# EAGLE design LB_BIT_i23-threshold-v03(1_1) (EAGLE 6.6.0)
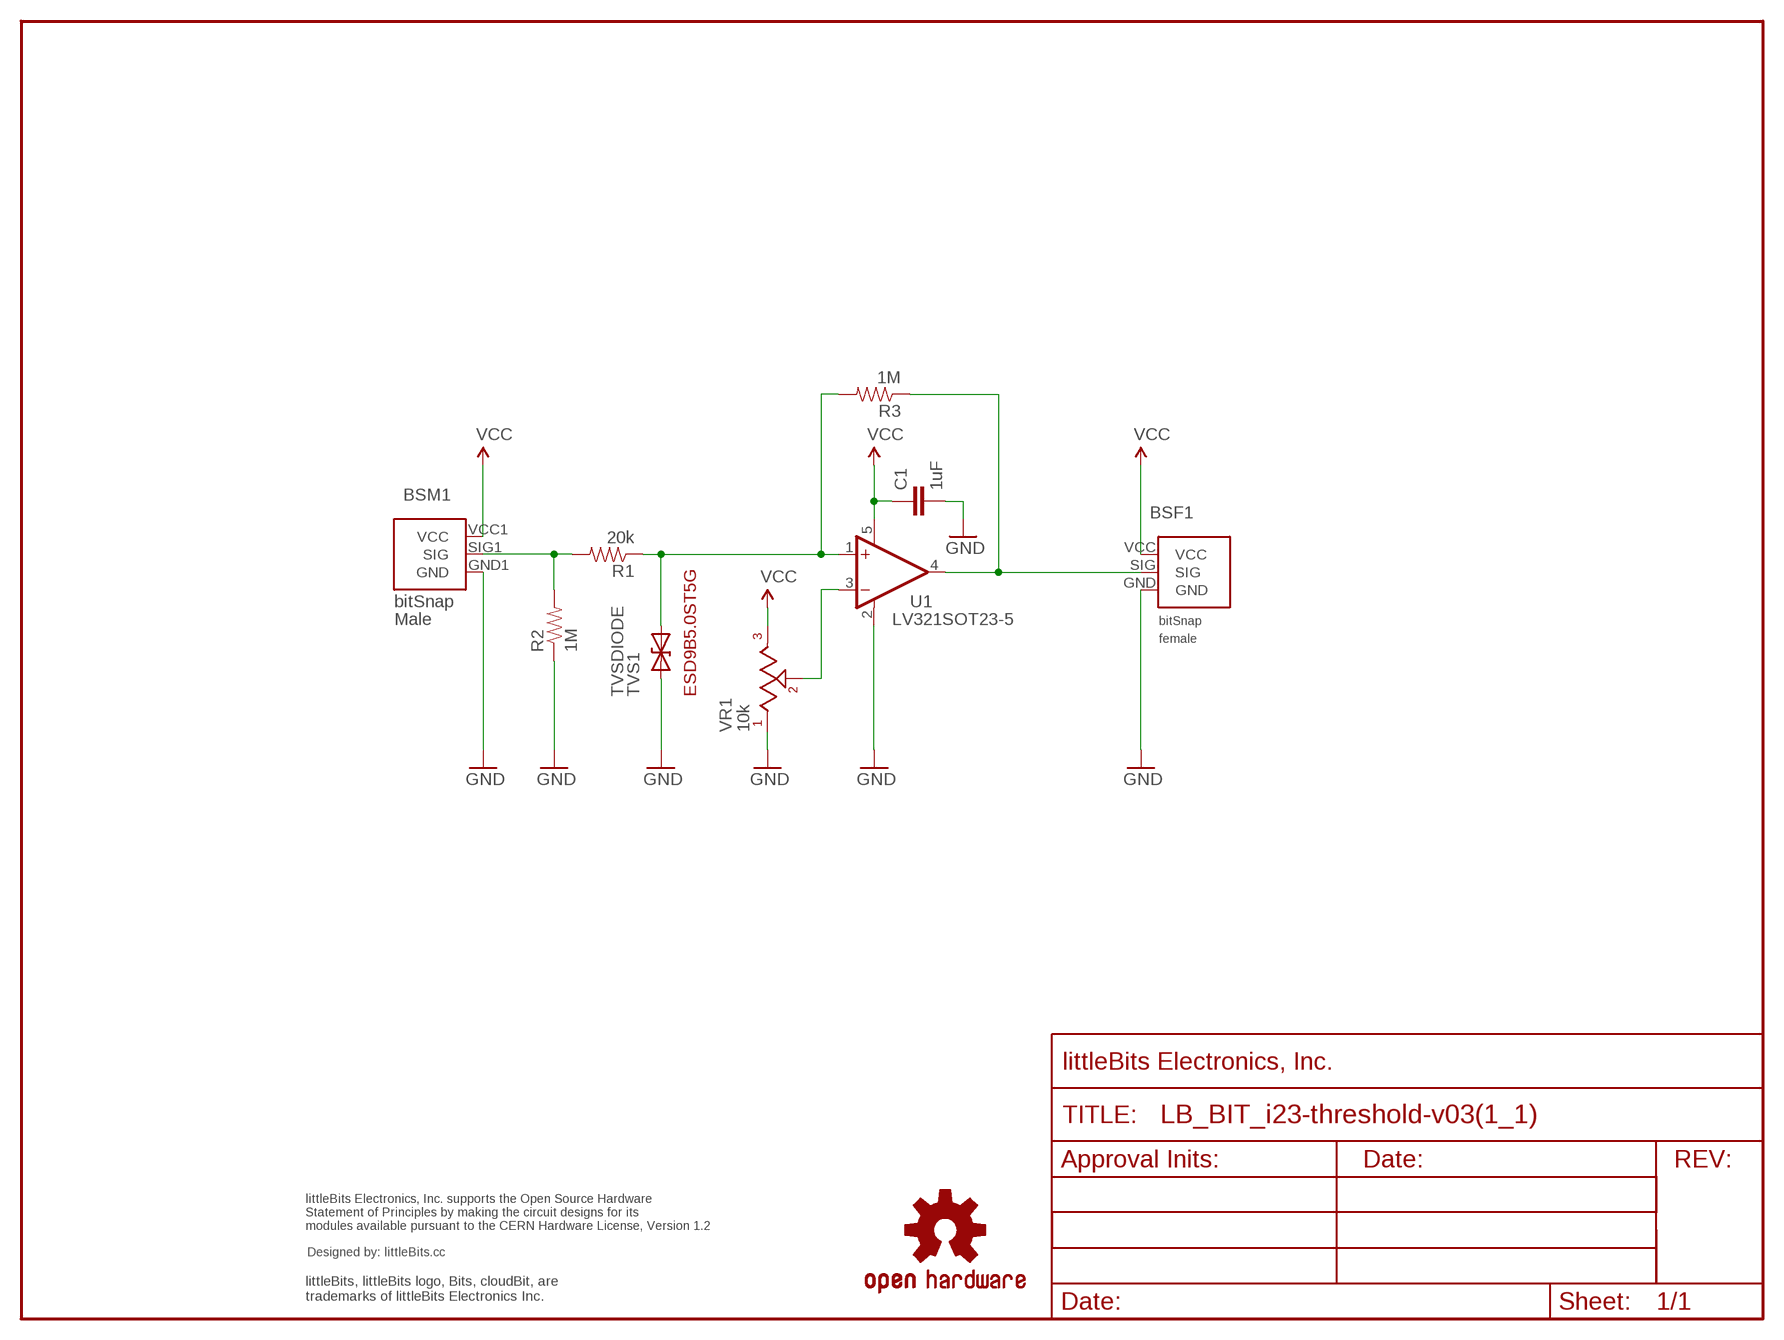
[diagram p0: schematic, sheet 1]

## Parts
BSF1  BITSNAP_V03_FEMALE  [BITSNAP_V03_FEMALE]
BSM1  BITSNAP_V03_MALE  [BITSNAP_V03_MALE]
C1  1uF  CAPCAP-0603  [CAP-0603]
R1  20k  RESISTOR0603  [RES-0603]
R2  1M  RESISTOR0603  [RES-0603]
R3  1M  RESISTOR0603  [RES-0603]
TVS1  TVSDIODE  DIODE-TVSSOD-923  [SOD-923]
U1  LV321SOT23-5  [SOT23-5]
U$3  OSHW-LOGOL  [OSHW-LOGO-L]
U$5  FRAME-LETTER-OHWOHW  [FABDWG01-OHW]
U$31  OSHWCREDIT  [OSHWCREDIT]
VR1  10k  9MM_POT  [9MM_POT]

## Nets
GND: BSF1.GND BSM1.GND1(GND) C1.2 R2.1 TVS1.1(A) U1.2(V-) VR1.1
N$1: BSM1.SIG1(SIG) R1.2 R2.2
N$2: U1.3(-IN) VR1.2
N$4: R1.1 R3.2 TVS1.2(C) U1.1(+IN)
N$8: BSF1.SIG R3.1 U1.4(OUT)
VCC: BSF1.VCC BSM1.VCC1(VCC) C1.1 U1.5(V+) VR1.3

## Library data of the parts
BSF1 = bitSnap:BITSNAP_V03_FEMALE
BSM1 = bitSnap:BITSNAP_V03_MALE
C1 = LITTLEBITS:CAP
R1-R3 = LITTLEBITS:RESISTOR
TVS1 = LITTLEBITS:DIODE-TVS: Bidirectional Transient Voltage Suppression Diode: Device conducts in avalanche mode after reaching a part dependent voltage threshold. Used for limiting voltage spikes on ESD sensitive inputs and outputs.; IEC_ESD_PROT0: +/-18kV; LB_PN: ?; MPN: ESD9B5.0ST5G; V_CLAMP: ?; V_OPERATION: 5V
U1 = LITTLEBITS:LV321
U$3 = LITTLEBITS:OSHW-LOGO: Open Source Hardware Logo This logo indicates the piece of hardware it is found on incorporates a OSHW license and/or adheres to the definition of open source hardware found here: http://freedomdefined.org/OSHW
U$5 = LITTLEBITS:FRAME-LETTER-OHW
U$31 = LITTLEBITS:OSHWCREDIT
VR1 = LITTLEBITS:9MM_POT

## Board
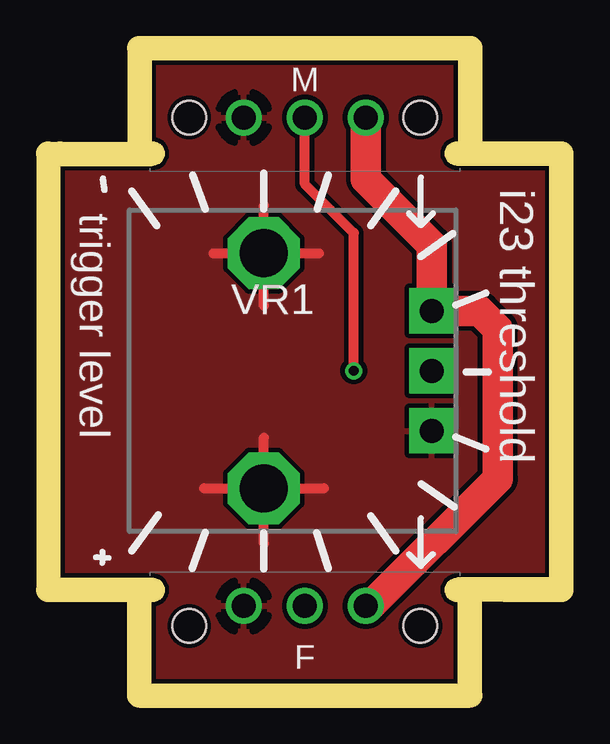
[diagram p1: board, top side]
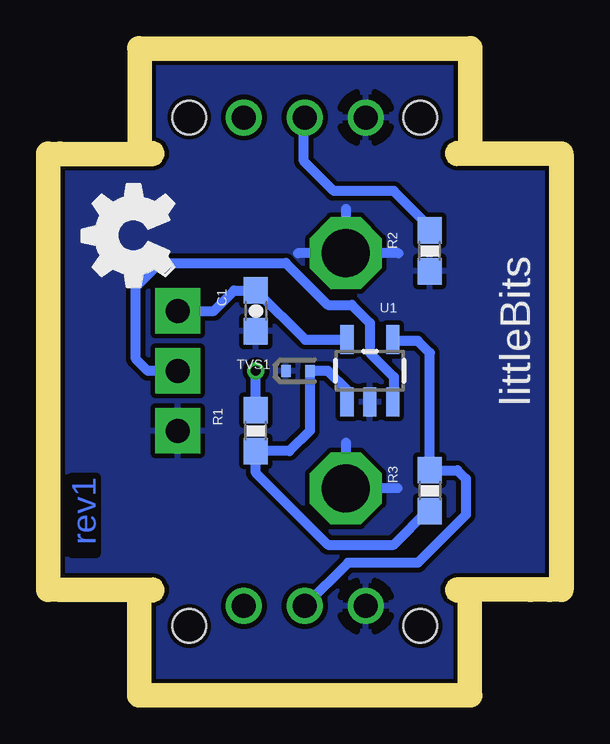
[diagram p2: board, bottom side, seen from below]

Size 20.4 x 26 mm. Coordinates in mm from the lower left corner, seen from the top.
Outline: 0,4.4 0,21.6
Outline: 20.4,4.4 20.4,21.6
Copper layers (1*16): Top 0.035mm / dielectric 1.5mm / Bottom 0.035mm
Design rules "littleBitsDRC": minimum track width 0.2mm, minimum drill 0.4mm, track to track 0.2mm, track to pad 0.2mm, pad to pad 0.2mm, via to via 0.2mm, smd to smd 0mil, copper to edge 0.2mm, drill to drill 0.2mm, minimum pad ring 0.2mm, minimum via ring 0.15mm, stop-mask expansion 0.1mm, vias tented up to drill 0mil, thermal gap 0.2mm
Milling: 6 lines

### Footprints (pad centres in the part's own frame; a part is rotated, then mirrored left to right if it is on the bottom)
BITSNAP_V03_FEMALE = drill 1: GND 4.065,3.44; SIG 6.605,3.44; VCC 9.145,3.44 | hole 1.4: 1.785,2.61; 11.425,2.61
BITSNAP_V03_MALE = drill 1: GND1 9.145,2.61; SIG1 6.605,2.61; VCC1 4.065,2.61 | hole 1.4: 1.785,2.61; 11.425,2.61
CAP-0603 = smd 1.1 x 1: 1 -0.85,0; 2 0.85,0
RES-0603 = smd 1.1 x 1: 1 -0.85,0; 2 0.85,0
SOD-923 = smd 0.4 x 0.5: 1 -0.5,0; 2 0.5,0
SOT23-5 = smd 0.55 x 1.2: 1 -0.95,-1.3; 2 0,-1.3; 3 0.95,-1.3; 4 0.95,1.3; 5 -0.95,1.3
9MM_POT = drill 1 pad 1.88 square: 1 7,-2.5; 2 7,0; 3 7,2.5 | drill 2 octagon: GND@1 0,4.9; GND@2 0,-4.9

### Placement (x,y rotation side)
BSF1  3.6,-0.21 0 top
BSM1  16.8,26.21 180 top
C1  12.24,15.54 270 bottom
R1  12.24,10.54 90 bottom
R2  4.99,18.04 90 bottom
R3  4.99,8.04 270 bottom
TVS1  10.49,13.04 0 bottom
U1  7.49,13.04 0 bottom
U$2  [OSHW_FILLX150_NOTEXT]  15.66,16.55 90 bottom
U$3  -27.51,-71.21 0 top  (outside the outline)
U$5  -3.01,-0.21 0 top  (outside the outline)
U$29  [+]  1.37,5.64 270 top
U$30  [-]  1.61,21.23 270 top
U$31  -95.21,-62.69 0 top  (outside the outline)
VR1  8.49,13.04 0 top

### Tracks (layer width: path | path; a pad name or v marks a point on that pad's centre or on a via)
GND
  Top 0.406: 8.49,5.84 8.49,10.24 | 5.99,8.14 10.99,8.14 | 8.49,15.74 8.49,19.94 | 6.39,17.94 10.79,17.94
  Bottom 0.406: 6.29,17.94 10.49,17.94 | 6.34,8.14 8.49,8.14 8.49,8.19 | 8.49,10.04 8.49,8.54 | 8.49,19.79 8.49,18.04
  pour Top: -1.01,-0.71 -1.01,26.79 20.99,26.79 20.99,-0.71
  pour Bottom: -0.76,-0.46 20.99,-0.46 20.99,26.54 1.49,26.54 -0.76,26.54
N$1  (via drill 0.41)
  Top 0.406: v12.24,13.04 12.24,18.79 10.2,20.83 BSM1.SIG1
  Bottom 0.406: R2.2 4.99,19.04 6.49,20.54 8.99,20.54 10.24,21.79 10.24,23.56 BSM1.SIG1 | R1.2 v12.24,13.04
N$2
  Bottom 0.406: VR1.2 16.74,13.04 17.24,13.54 17.24,16.54 16.24,17.54 10.99,17.54 9.24,15.79 8.24,15.79 7.49,15.04 7.49,13.79 6.49,12.79 6.49,11.79 U1.3
N$4
  Bottom 0.406: U1.1 8.44,12.24 9.24,13.04 TVS1.2 9.99,10.54 10.84,9.69 R1.1 12.24,8.79 9.24,5.79 6.49,5.79 5.09,7.19 R3.2
N$8
  Bottom 0.406: BSF1.SIG 8.39,5.04 5.49,5.04 3.49,7.04 3.49,8.54 3.84,8.89 R3.1 4.99,13.79 5.49,14.29 6.49,14.29 U1.4
VCC
  Top 1.27: BSF1.VCC 12.93,3.23 18.24,8.54 18.24,14.79 17.49,15.54 VR1.3 15.49,18.29 12.74,21.04 BSM1.VCC1
  Bottom 0.406: VR1.3 13.99,15.54 13.14,16.39 C1.1 10.19,14.34 U1.5

### Text on the board
Bottom: rev1
tPlace: i23 threshold | trigger level
bPlace: littleBits
Milling: 1mm Router Path
dxf: 1 | i23 Threshold
tDocu: BSM1 | BSF1